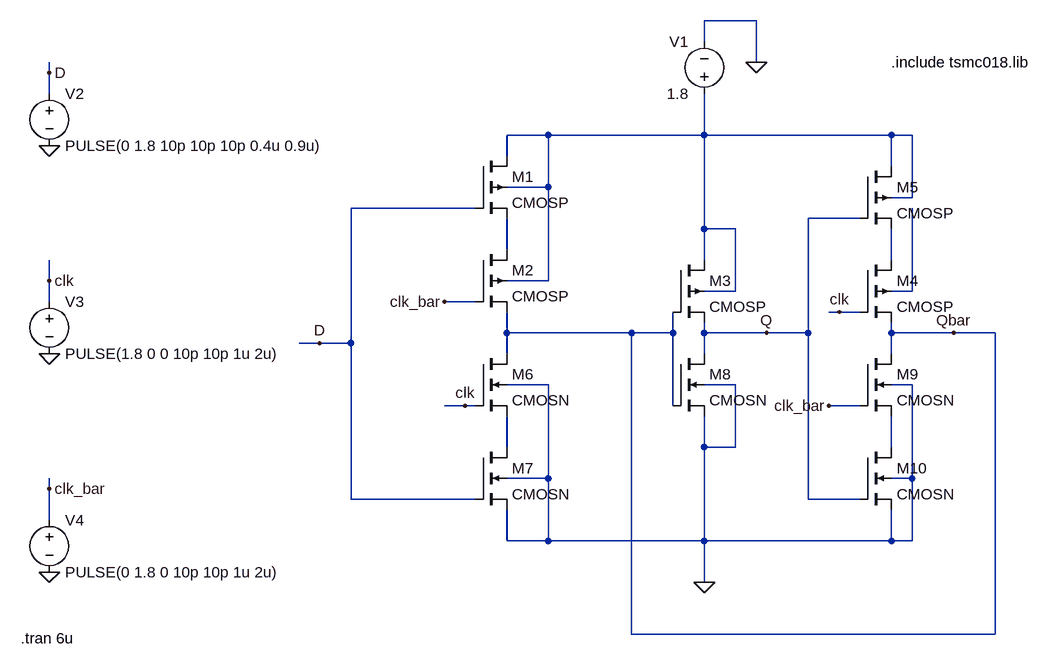
[diagram p0: schematic d_ff_ccmos.asc]
d_ff_ccmos.asc, the LTspice schematic file:
Version 4
SHEET 1 956 728
WIRE 512 -240 432 -240
WIRE 432 -208 432 -240
WIRE 512 -176 512 -240
WIRE -576 -160 -576 -176
WIRE -576 -128 -576 -160
WIRE 192 -64 128 -64
WIRE 432 -64 432 -128
WIRE 432 -64 192 -64
WIRE 720 -64 432 -64
WIRE 752 -64 720 -64
WIRE 128 -32 128 -64
WIRE 720 -16 720 -64
WIRE 192 16 192 -64
WIRE 192 16 128 16
WIRE 752 32 752 -64
WIRE 752 32 720 32
WIRE 80 48 -112 48
WIRE 672 64 592 64
WIRE 432 80 432 -64
WIRE 480 80 432 80
WIRE 128 112 128 64
WIRE 432 128 432 80
WIRE 720 128 720 80
WIRE -576 160 -576 128
WIRE 192 160 192 16
WIRE 192 160 128 160
WIRE 480 176 480 80
WIRE 480 176 432 176
WIRE 752 176 752 48
WIRE 752 176 720 176
WIRE -576 192 -576 160
WIRE 80 192 32 192
WIRE 640 208 624 208
WIRE 672 208 640 208
WIRE 128 240 128 208
WIRE 320 240 128 240
WIRE 384 240 384 208
WIRE 384 240 320 240
WIRE 432 240 432 224
WIRE 528 240 432 240
WIRE 592 240 592 64
WIRE 592 240 528 240
WIRE 720 240 720 224
WIRE 816 240 720 240
WIRE 880 240 816 240
WIRE -160 256 -192 256
WIRE -112 256 -112 48
WIRE -112 256 -160 256
WIRE 128 272 128 240
WIRE 432 272 432 240
WIRE 720 272 720 240
WIRE 192 320 128 320
WIRE 480 320 432 320
WIRE 752 320 720 320
WIRE 64 352 32 352
WIRE 80 352 64 352
WIRE 384 352 384 240
WIRE 672 352 624 352
WIRE 128 416 128 368
WIRE 432 416 432 368
WIRE 480 416 480 320
WIRE 480 416 432 416
WIRE 720 416 720 368
WIRE 192 464 192 320
WIRE 192 464 128 464
WIRE 752 464 752 320
WIRE 752 464 720 464
WIRE -576 480 -576 464
WIRE -112 496 -112 256
WIRE 80 496 -112 496
WIRE 592 496 592 240
WIRE 672 496 592 496
WIRE -576 528 -576 480
WIRE 128 560 128 512
WIRE 192 560 192 464
WIRE 192 560 128 560
WIRE 432 560 432 416
WIRE 432 560 192 560
WIRE 720 560 720 512
WIRE 720 560 432 560
WIRE 752 560 752 464
WIRE 752 560 720 560
WIRE 432 624 432 560
WIRE 320 704 320 240
WIRE 880 704 880 240
WIRE 880 704 320 704
FLAG 512 -176 0
FLAG 432 624 0
FLAG -576 -48 0
FLAG -576 272 0
FLAG -576 608 0
FLAG -576 -160 D
FLAG -160 256 D
FLAG -576 160 clk
FLAG 64 352 clk
FLAG 640 208 clk
FLAG -576 480 clk_bar
FLAG 32 192 clk_bar
FLAG 624 352 clk_bar
FLAG 528 240 Q
FLAG 816 240 Qbar
SYMBOL cmosp 80 -32 R0
SYMATTR InstName M1
SYMATTR Value2 l=180n w=1600n
SYMBOL cmosp 80 112 R0
SYMATTR InstName M2
SYMATTR Value2 l=180n w=1600n
SYMBOL cmosp 384 128 R0
SYMATTR InstName M3
SYMATTR Value2 l=180n w=1600n
SYMBOL cmosp 672 128 R0
SYMATTR InstName M4
SYMATTR Value2 l=180n w=800n
SYMBOL cmosp 672 -16 R0
SYMATTR InstName M5
SYMATTR Value2 l=180n w=800n
SYMBOL cmosn 80 272 R0
SYMATTR InstName M6
SYMATTR Value2 l=180n w=800n
SYMBOL cmosn 80 416 R0
SYMATTR InstName M7
SYMATTR Value2 l=180n w=400n
SYMBOL cmosn 384 272 R0
SYMATTR InstName M8
SYMATTR Value2 l=180n w=800n
SYMBOL cmosn 672 272 R0
SYMATTR InstName M9
SYMATTR Value2 l=180n w=800n
SYMBOL cmosn 672 416 R0
SYMATTR InstName M10
SYMATTR Value2 l=180n w=400n
SYMBOL voltage 432 -112 R180
WINDOW 0 24 96 Left 2
WINDOW 3 24 16 Left 2
WINDOW 123 0 0 Left 0
WINDOW 39 0 0 Left 0
SYMATTR InstName V1
SYMATTR Value 1.8
SYMBOL voltage -576 -144 R0
WINDOW 123 0 0 Left 0
WINDOW 39 0 0 Left 0
SYMATTR InstName V2
SYMATTR Value PULSE(0 1.8 10p 10p 10p 0.4u 0.9u)
SYMBOL voltage -576 176 R0
WINDOW 123 0 0 Left 0
WINDOW 39 0 0 Left 0
SYMATTR InstName V3
SYMATTR Value PULSE(1.8 0 0 10p 10p 1u 2u)
SYMBOL voltage -576 512 R0
WINDOW 123 0 0 Left 0
WINDOW 39 0 0 Left 0
SYMATTR InstName V4
SYMATTR Value PULSE(0 1.8 0 10p 10p 1u 2u)
TEXT 720 -176 Left 2 !.include tsmc018.lib
TEXT -620 710 Left 2 !.tran 6u

The netlist it stands for:
* d_ff_ccmos.asc
M1 N001 D N002 N001 CMOSP l=180n w=1600n
M2 N002 clk_bar Qbar N001 CMOSP l=180n w=1600n
M3 N001 Qbar Q N001 CMOSP l=180n w=1600n
M4 N003 clk Qbar N004 CMOSP l=180n w=800n
M5 N001 Q N003 N001 CMOSP l=180n w=800n
M6 Qbar clk N005 0 CMOSN l=180n w=800n
M7 N005 D 0 0 CMOSN l=180n w=400n
M8 Q Qbar 0 0 CMOSN l=180n w=800n
M9 Qbar clk_bar N006 0 CMOSN l=180n w=800n
M10 N006 Q 0 0 CMOSN l=180n w=400n
V1 N001 0 1.8
V2 D 0 PULSE(0 1.8 10p 10p 10p 0.4u 0.9u)
V3 clk 0 PULSE(1.8 0 0 10p 10p 1u 2u)
V4 clk_bar 0 PULSE(0 1.8 0 10p 10p 1u 2u)
.model NMOS NMOS
.model PMOS PMOS
.lib standard.mos
.include tsmc018.lib
.tran 6u
.backanno
.end